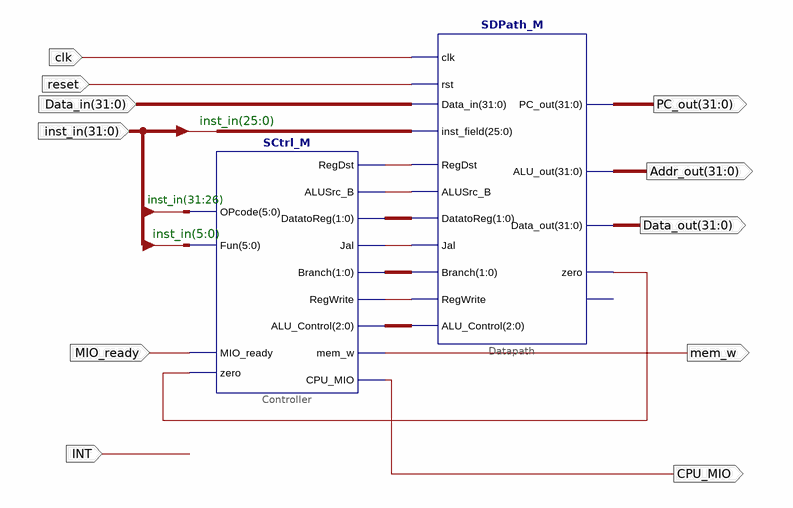
[diagram p0: schematic sheet 1]
// Xilinx ISE schematic SCPU_M.sch (kintex7) as structural Verilog: 2 symbols, 11 ports
module SCPU_M (
  input  clk,
  input  INT,
  input  [31:0] inst_in,
  input  reset,
  input  [31:0] Data_in,
  input  MIO_ready,
  output CPU_MIO,
  output mem_w,
  output [31:0] PC_out,
  output [31:0] Addr_out,
  output [31:0] Data_out
);

  wire XLXN_2, XLXN_3, XLXN_5, XLXN_8, XLXN_12;
  wire [1:0] XLXN_9, XLXN_10;
  wire [2:0] XLXN_7;

  SCtrl_M Controller (
    .RegDst(XLXN_2), .ALUSrc_B(XLXN_3), .DatatoReg(XLXN_9), .Jal(XLXN_5), .ALU_Control(XLXN_7),
    .CPU_MIO(CPU_MIO), .mem_w(mem_w), .Fun(inst_in[5:0]), .OPcode(inst_in[31:26]), .Branch(XLXN_10),
    .RegWrite(XLXN_8), .MIO_ready(MIO_ready), .zero(XLXN_12));
  SDPath_M Datapath (
    .RegDst(XLXN_2), .ALUSrc_B(XLXN_3), .DatatoReg(XLXN_9), .Jal(XLXN_5), .Branch(XLXN_10),
    .RegWrite(XLXN_8), .ALU_Control(XLXN_7), .Data_in(Data_in), .inst_field(inst_in[25:0]), .clk(clk),
    .rst(reset), .PC_out(PC_out), .ALU_out(Addr_out), .Data_out(Data_out), .zero(XLXN_12));  // open: overflow

  // Notes on the sheet:
  //   inst_in(25:0)
  //   inst_in(31:26)
  //   inst_in(5:0)
endmodule
